# Altium schematic sheet Amplifiers.SchDoc: Electrochemical Sensor Input
size A4; DocumentNumber: 2; Revision: D; SheetNumber: 2; SheetTotal: 7
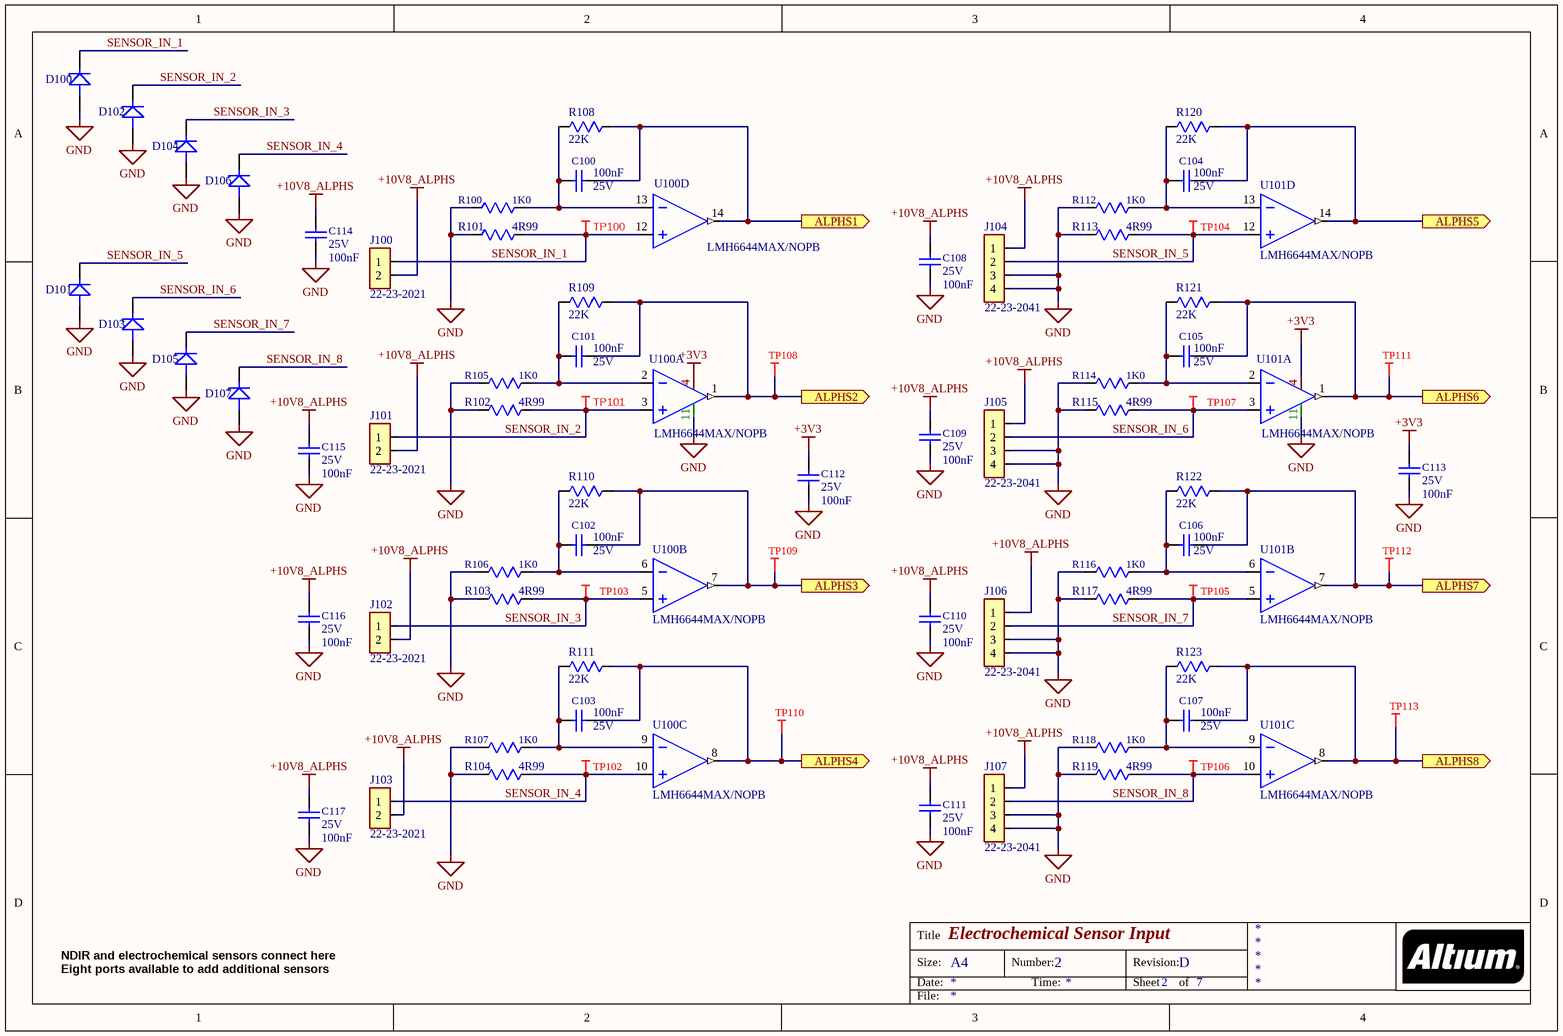
[diagram p0: Amplifiers.SchDoc]

## Parts
C100  value 100nF  Voltage: 25V  [CAPC1005X06N]  (hidden comment: 4.7uF)
C101  value 100nF  Voltage: 25V  [CAPC1005X06N]  (hidden comment: 4.7uF)
C102  value 100nF  Voltage: 25V  [CAPC1005X06N]  (hidden comment: 4.7uF)
C103  value 100nF  Voltage: 25V  [CAPC1005X06N]  (hidden comment: 4.7uF)
C104  value 100nF  Voltage: 25V  [CAPC1005X06N]  (hidden comment: 4.7uF)
C105  value 100nF  Voltage: 25V  [CAPC1005X06N]  (hidden comment: 4.7uF)
C106  value 100nF  Voltage: 25V  [CAPC1005X06N]  (hidden comment: 4.7uF)
C107  value 100nF  Voltage: 25V  [CAPC1005X06N]  (hidden comment: 4.7uF)
C108  value 100nF  Voltage: 25V  [CAPC1005X06N]  (hidden comment: 4.7uF)
C109  value 100nF  Voltage: 25V  [CAPC1005X06N]  (hidden comment: 4.7uF)
C110  value 100nF  Voltage: 25V  [CAPC1005X06N]  (hidden comment: 4.7uF)
C111  value 100nF  Voltage: 25V  [CAPC1005X06N]  (hidden comment: 4.7uF)
C112  value 100nF  Voltage: 25V  [CAPC1005X06N]  (hidden comment: 4.7uF)
C113  value 100nF  Voltage: 25V  [CAPC1005X06N]  (hidden comment: 4.7uF)
C114  value 100nF  Voltage: 25V  [CAPC1005X06N]  (hidden comment: 4.7uF)
C115  value 100nF  Voltage: 25V  [CAPC1005X06N]  (hidden comment: 4.7uF)
C116  value 100nF  Voltage: 25V  [CAPC1005X06N]  (hidden comment: 4.7uF)
C117  value 100nF  Voltage: 25V  [CAPC1005X06N]  (hidden comment: 4.7uF)
D100  5V TVS  [NXP PTVSxS1UR-Series (SOD123W)]  (value not drawn)
D101  5V TVS  [NXP PTVSxS1UR-Series (SOD123W)]  (value not drawn)
D102  5V TVS  [NXP PTVSxS1UR-Series (SOD123W)]  (value not drawn)
D103  5V TVS  [NXP PTVSxS1UR-Series (SOD123W)]  (value not drawn)
D104  5V TVS  [NXP PTVSxS1UR-Series (SOD123W)]  (value not drawn)
D105  5V TVS  [NXP PTVSxS1UR-Series (SOD123W)]  (value not drawn)
D106  5V TVS  [NXP PTVSxS1UR-Series (SOD123W)]  (value not drawn)
D107  5V TVS  [NXP PTVSxS1UR-Series (SOD123W)]  (value not drawn)
J100  22-23-2021  [22-23-2021]
J101  22-23-2021  [22-23-2021]
J102  22-23-2021  [22-23-2021]
J103  22-23-2021  [22-23-2021]
J104  22-23-2041  [22-23-2041]
J105  22-23-2041  [22-23-2041]
J106  22-23-2041  [22-23-2041]
J107  22-23-2041  [22-23-2041]
R100  1K0  [RESC1005X03N]
R101  4R99  [RESC1005X03N]
R102  4R99  [RESC1005X03N]
R103  4R99  [RESC1005X03N]
R104  4R99  [RESC1005X03N]
R105  1K0  [RESC1005X03N]
R106  1K0  [RESC1005X03N]
R107  1K0  [RESC1005X03N]
R108  22K  [RESC1005X03N]
R109  22K  [RESC1005X03N]
R110  22K  [RESC1005X03N]
R111  22K  [RESC1005X03N]
R112  1K0  [RESC1005X03N]
R113  4R99  [RESC1005X03N]
R114  1K0  [RESC1005X03N]
R115  4R99  [RESC1005X03N]
R116  1K0  [RESC1005X03N]
R117  4R99  [RESC1005X03N]
R118  1K0  [RESC1005X03N]
R119  4R99  [RESC1005X03N]
R120  22K  [RESC1005X03N]
R121  22K  [RESC1005X03N]
R122  22K  [RESC1005X03N]
R123  22K  [RESC1005X03N]
TP100  PAD  [TP_SMD_39MIL]  (value not drawn)  (no BOM)
TP101  PAD  [TP_SMD_39MIL]  (value not drawn)  (no BOM)
TP102  PAD  [TP_SMD_39MIL]  (value not drawn)  (no BOM)
TP103  PAD  [TP_SMD_39MIL]  (value not drawn)  (no BOM)
TP104  PAD  [TP_SMD_39MIL]  (value not drawn)  (no BOM)
TP105  PAD  [TP_SMD_39MIL]  (value not drawn)  (no BOM)
TP106  PAD  [TP_SMD_39MIL]  (value not drawn)  (no BOM)
TP107  PAD  [TP_SMD_39MIL]  (value not drawn)  (no BOM)
TP108  PAD  [TP_SMD_39MIL]  (value not drawn)  (no BOM)
TP109  PAD  [TP_SMD_39MIL]  (value not drawn)  (no BOM)
TP110  PAD  [TP_SMD_39MIL]  (value not drawn)  (no BOM)
TP111  PAD  [TP_SMD_39MIL]  (value not drawn)  (no BOM)
TP112  PAD  [TP_SMD_39MIL]  (value not drawn)  (no BOM)
TP113  PAD  [TP_SMD_39MIL]  (value not drawn)  (no BOM)
U100  LMH6644MAX/NOPB  [SOIC-14]  (parts A,B,C,D of 4)
U101  LMH6644MAX/NOPB  [SOIC-14]  (parts A,B,C,D of 4)

## Ports
ALPHS1 (out), ALPHS2 (out), ALPHS3 (out), ALPHS4 (out), ALPHS5 (out), ALPHS6 (out), ALPHS7 (out), ALPHS8 (out)

## Nets
+3V3: C112.2 C113.2 U100.4(Vdd) U101.4(Vdd)
+10V8_ALPHS: C108.2 C109.2 C110.2 C111.2 C114.2 C115.2 C116.2 C117.2 J100.2 J101.2 J102.2 J103.2 J104.1 J105.1 J106.1 J107.1
GND: C108.1 C109.1 C110.1 C111.1 C112.1 C113.1 C114.1 C115.1 C116.1 C117.1 D100.2 D101.2 D102.2 D103.2 D104.2 D105.2 D106.2 D107.2 J104.3 J104.4 J105.3 J105.4 J106.3 J106.4 J107.3 J107.4 R100.1 R101.1 R102.1 R103.1 R104.1 R105.1 R106.1 R107.1 R112.1 R113.1 R114.1 R115.1 R116.1 R117.1 R118.1 R119.1 U100.11(Vss) U101.11(Vss)
ALPHS1: C100.2 R108.2 U100.14(OutD) ; port ALPHS1
ALPHS2: C101.2 R109.2 TP108.1 U100.1(OutA) ; port ALPHS2
ALPHS3: C102.2 R110.2 TP109.1 U100.7(OutB) ; port ALPHS3
ALPHS4: C103.2 R111.2 TP110.1 U100.8(OutC) ; port ALPHS4
ALPHS5: C104.2 R120.2 U101.14(OutD) ; port ALPHS5
ALPHS6: C105.2 R121.2 TP111.1 U101.1(OutA) ; port ALPHS6
ALPHS7: C106.2 R122.2 TP112.1 U101.7(OutB) ; port ALPHS7
ALPHS8: C107.2 R123.2 TP113.1 U101.8(OutC) ; port ALPHS8
SENSOR_IN_1: D100.1 J100.1 R101.2 TP100.1 U100.12(+InD)
SENSOR_IN_2: D102.1 J101.1 R102.2 TP101.1 U100.3(+InA)
SENSOR_IN_3: D104.1 J102.1 R103.2 TP103.1 U100.5(+InB)
SENSOR_IN_4: D106.1 J103.1 R104.2 TP102.1 U100.10(+InC)
SENSOR_IN_5: D101.1 J104.2 R113.2 TP104.1 U101.12(+InD)
SENSOR_IN_6: D103.1 J105.2 R115.2 TP107.1 U101.3(+InA)
SENSOR_IN_7: D105.1 J106.2 R117.2 TP105.1 U101.5(+InB)
SENSOR_IN_8: D107.1 J107.2 R119.2 TP106.1 U101.10(+InC)
NetC100_1: C100.1 R100.2 R108.1 U100.13(-InD)
NetC101_1: C101.1 R105.2 R109.1 U100.2(-InA)
NetC102_1: C102.1 R106.2 R110.1 U100.6(-InB)
NetC103_1: C103.1 R107.2 R111.1 U100.9(-InC)
NetC104_1: C104.1 R112.2 R120.1 U101.13(-InD)
NetC105_1: C105.1 R114.2 R121.1 U101.2(-InA)
NetC106_1: C106.1 R116.2 R122.1 U101.6(-InB)
NetC107_1: C107.1 R118.2 R123.1 U101.9(-InC)

## Notes on the sheet
- NDIR and electrochemical sensors connect here
- Eight ports available to add additional sensors
- Title
- Size:
- Date:
- A4
- Number:
- Time:
- Revision:
- Sheet
- of
- File:

## Library data of the parts
C100-C117 = 4.7uF_0603_10V: Manufacturer Part Number: CL05A104KA5NNNC; Manufacturer: Samsung; ComponentLink1URL: http://www.murata.com/~/media/webrenewal/support/library/catalog/products/capacitor/mlcc/c02e.pdf; ComponentLink1Description: http://www.murata.com/~/media/webrenewal/support/library/catalog/products/capacitor/mlcc/c02e.pdf; Supplier 1: Digi-Key; Supplier Part Number 1: 1276-1043-1-ND
D100-D107 = NXP PTVSxS1UR-Series: Manufacturer: Nexperia; Manufacturer Part Number: PTVS5V0S1UR,115; Supplier 1: Digi-Key; Supplier Part Number 1: 1727-5229-1-ND
J100-J103 = 22-23-2021: CONN HEADER VERT 2POS 2.54MM; Manufacturer: Molex; Value: *; Supplier Part Number 1: WM4200-ND; Supplier 1: Digi-Key; Manufacturer Part Number: 22-23-2021
J104-J107 = 22-23-2041: Connector Header Through Hole 4 position 0.100" (2.54mm); Manufacturer: Molex; Manufacturer Part Number: 0022232041; Value: *; Supplier Part Number 1: WM4202-ND; Supplier 1: Digi-Key
R100 R105-R107 R112 R114 R116 R118 = 1K00_0603_0.1W: RES 1K Ohm ±5%, 0.25W,1/4W 0603; Manufacturer: Panasonic; Manufacturer Part Number: ERJ-2RKF1001X; ComponentLink1URL: https://datasheet.ciiva.com/2469/esr-2469603.pdf; ComponentLink1Description: https://datasheet.ciiva.com/2469/esr-2469603.pdf; ComponentLink2URL: https://datasheet.ciiva.com/2469/esr-2469604.pdf; ComponentLink2Description: https://datasheet.ciiva.com/2469/esr-2469604.pdf; ComponentLink3URL: https://datasheet.ciiva.com/2469/esr-2469605.pdf; ComponentLink3Description: https://datasheet.ciiva.com/2469/esr-2469605.pdf; Supplier Part Number 1: P1.00KLCT-ND; Supplier 1: Digi-Key; Value: 1k
R101-R104 R113 R115 R117 R119 = 4R99_0603_1/4W: Res,SMD,4R99,1/4W,5%; Manufacturer: Stackpole; Manufacturer Part Number: RMCF0402FT4R99; Supplier Part Number 1: RMCF0402FT4R99CT-ND; Supplier 1: Digi-Key; Value: 4R99
R108-R111 R120-R123 = 22K_0603_1/4W: Res,SMD,22k,0603,5%,1/4W; Manufacturer Part Number: ERJ-2RKF2202X; Manufacturer: Panasonic; Supplier Part Number 1: P22.0KLDKR-ND; Supplier 1: Digi-Key; Value: 22k
TP100-TP113 = TP_SMD_39MIL: SMD Test Pad; Manufacturer: No P/N Required; P/N: No P/N; UM: EA; Fast Supplier: No P/N Required; Fast Supplier P/N: No P/N Required; Manufacturer P/N: No P/N Required
U100 U101 = LM660: Quad opamplifiers; Manufacturer: Texas Instruments; Supplier 1: Digi-Key; Supplier Part Number 1: 296-35336-1-ND; Manufacturer Part Number: LMH6644MAX/NOPB